# EAGLE design untitled (EAGLE 6.4)
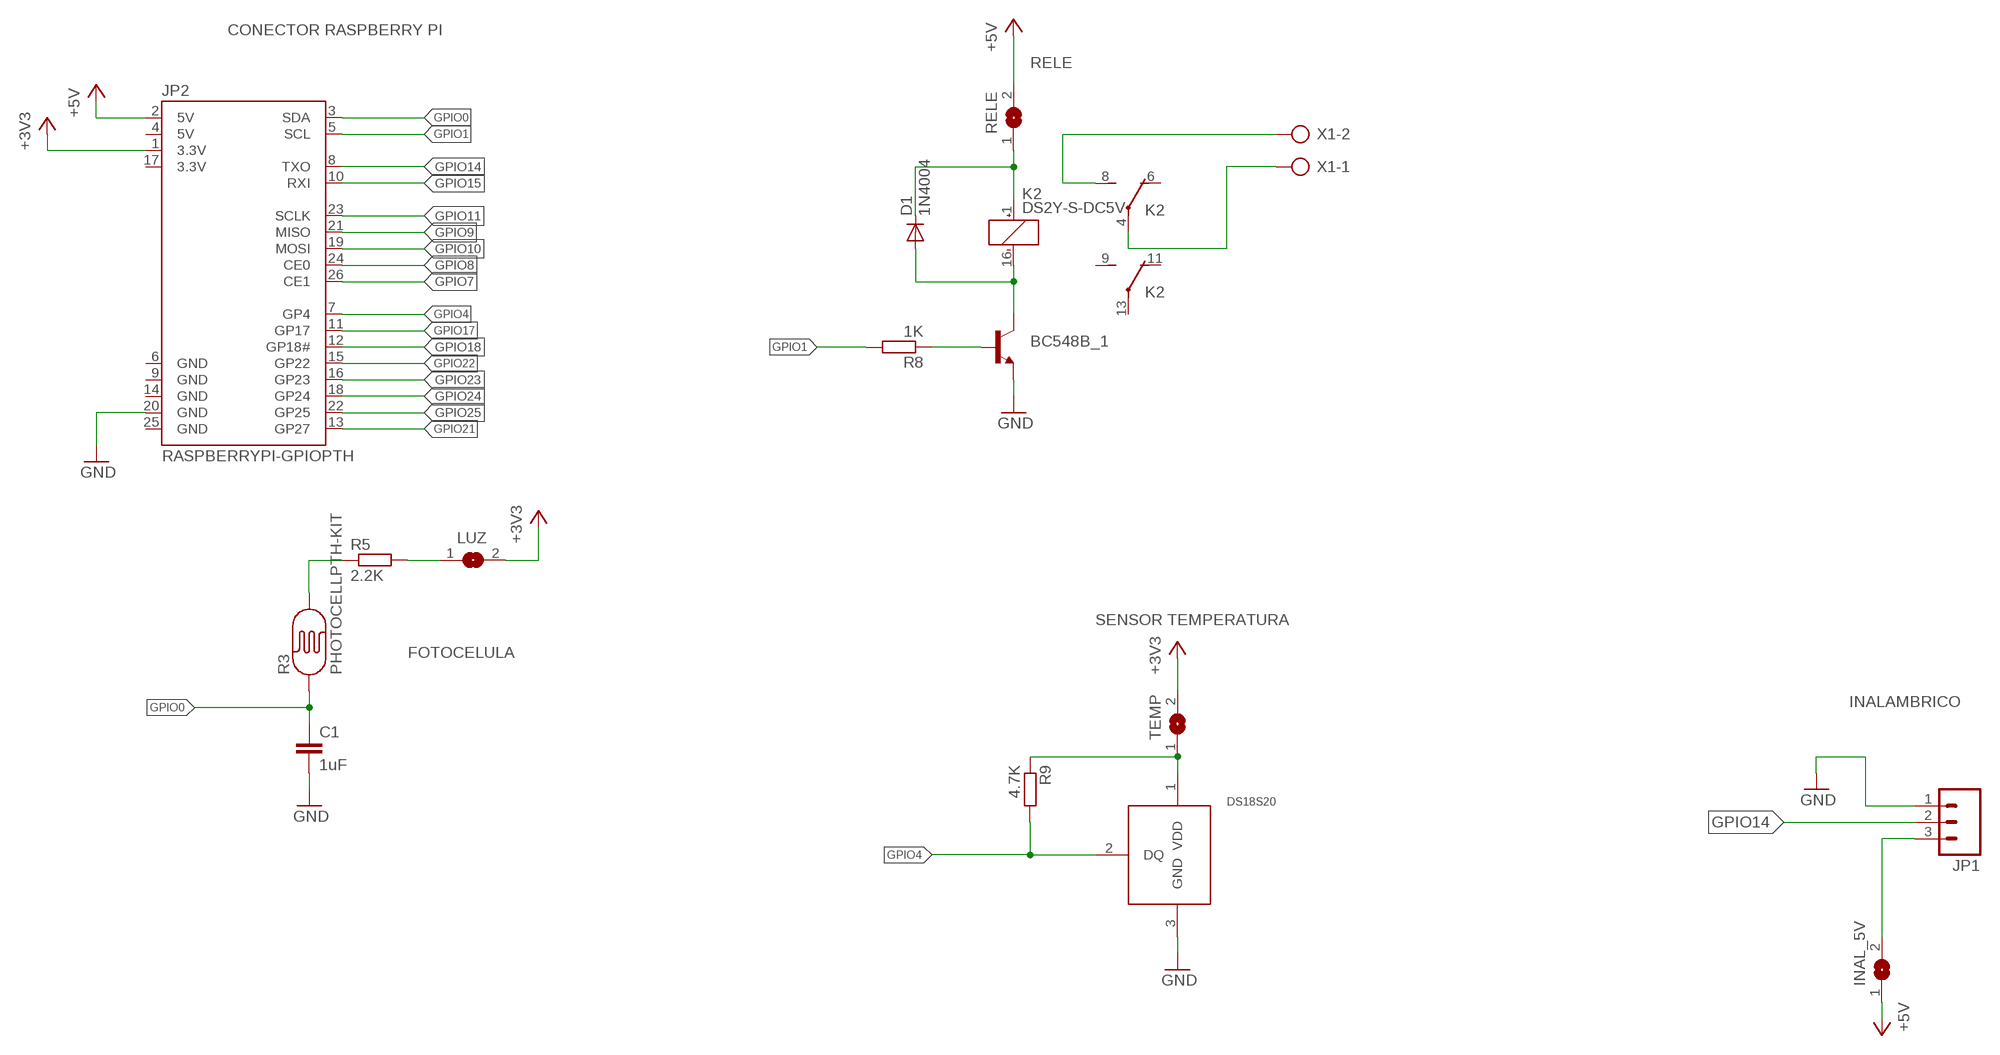
[diagram p0: schematic, sheet 1]

## Parts
BC548B_1  TRANSISTOR_NPNTO-92-AMMO  [TO-92-AMMO]
C1  1uF  C5/3.5  [C5B3.5]
D1  1N4004  [DO41-10]
DS18S20  18S20  [TO-92]
INAL_5V  SJ  [SJ]
JP1  M03POLAR  [MOLEX-1X3]
JP2  RASPBERRYPI-GPIOPTH  [2X13-SHROUDED]
K2  DS2Y-S-DC5V  [DS2Y]
LUZ  SJ  [SJ]
R3  PHOTOCELLPTH-KIT  [PHOTOCELL-KIT]
R5  2.2K  R-EU_0207/10  [0207/10]
R8  1K  R-EU_0207/10  [0207/10]
R9  4.7K  R-EU_0207/10  [0207/10]
RELE  SJ  [SJ]
TEMP  SJ  [SJ]
X1  AK500/2  [AK500/2]

## Nets
+3V3: JP2.1(3.3V) LUZ.2 TEMP.2
+5V: INAL_5V.1 JP2.2(5V) RELE.2
GND: BC548B_1.1(E) C1.2 DS18S20.3(GND) JP1.1 JP2.20(GND)
GPIO0: C1.1 JP2.3(SDA) R3.1
GPIO1: JP2.5(SCL) R8.2
GPIO4: DS18S20.2(DQ) JP2.7(GP4) R9.2
GPIO7: JP2.26(CE1)
GPIO8: JP2.24(CE0)
GPIO9: JP2.21(MISO)
GPIO10: JP2.19(MOSI)
GPIO11: JP2.23(SCLK)
GPIO14: JP1.2 JP2.8(TXO)
GPIO15: JP2.10(RXI)
GPIO17: JP2.11(GP17)
GPIO18: JP2.12(GP18#)
GPIO21: JP2.13(GP27)
GPIO22: JP2.15(GP22)
GPIO23: JP2.16(GP23)
GPIO24: JP2.18(GP24)
GPIO25: JP2.22(GP25)
N$1: BC548B_1.3(C) D1.A K2.16(1:-)
N$2: DS18S20.1(VDD) R9.1 TEMP.1
N$3: R3.2 R5.1
N$4: BC548B_1.2(B) R8.1
N$6: K2.8(2:S) X1.2
N$9: K2.4(2:P) X1.1
N$10: LUZ.1 R5.2
N$11: D1.C K2.1(1:+) RELE.1
N$14: INAL_5V.2 JP1.3
Unconnected: K2.6(2:O) K2.9(3:S) K2.11(3:O) K2.13(3:P)

## Notes on the sheet
- CONECTOR RASPBERRY PI
- RELE
- SENSOR TEMPERATURA
- FOTOCELULA
- INALAMBRICO

## Power pins joined to a net without a drawn wire
3.3V: JP2.17(3.3V)
5V: JP2.4(5V)
GND: JP2.6(GND) JP2.9(GND) JP2.14(GND) JP2.25(GND)

## Library data of the parts
BC548B_1 = SparkFun:TRANSISTOR_NPN: Transistor NPN BJT configuration in SOT23 package. MMBT2222 is the common NPN we use. Double check BCE configuration again layout.
C1 = capacitor-wima:C: CAPACITOR naming: grid - package width
D1 = diode:1N4004: DIODE general purpose rectifier, 1 A
DS18S20 = merriman:18S20: Dallas/Maxim 18S20 1-Wire temperature sensor (including PAR, since assumes pin 3 NOT connected internally on that variant)
INAL_5V LUZ RELE TEMP = jumper:SJ: SMD solder JUMPER
JP1 = SparkFun:M03: Header 3 Standard 3-pin 0.1" header. Use with straight break away headers (SKU : PRT-00116), right angle break away headers (PRT-00553), swiss pins (PRT-00743), machine pins (PRT-00117), and female headers (PRT-00115). Molex polarized connector foot print use with SKU : PRT-08232 with associated crimp pins and housings.
JP2 = SparkFun-Boards:RASPBERRYPI-GPIO: RASPBERRY PI I/O HEADER As defined for the Revistion 2 Pi.; DIST: sparkfun; DIST_ID: PRT-11490
K2 = relay:DS2Y-S-DC*: MINIATURE RELAY NAiS Source: http://www.mew-europe.com/.. en_ds_61005_0023.pdf
R3 = SparkFun:PHOTOCELL: Photocell Also known as a CdS photoresistor. This is a low cost way to detect light levels. Resistance decreases with more incoming light. SparkFun SKU: SEN-09088
R5 R8 R9 = rcl:R-EU_: RESISTOR, European symbol
X1 = con-ptr500:AK500/2: CONNECTOR

## Net classes
1 power: width 0.6 mm, clearance 0.3 mm

## Board
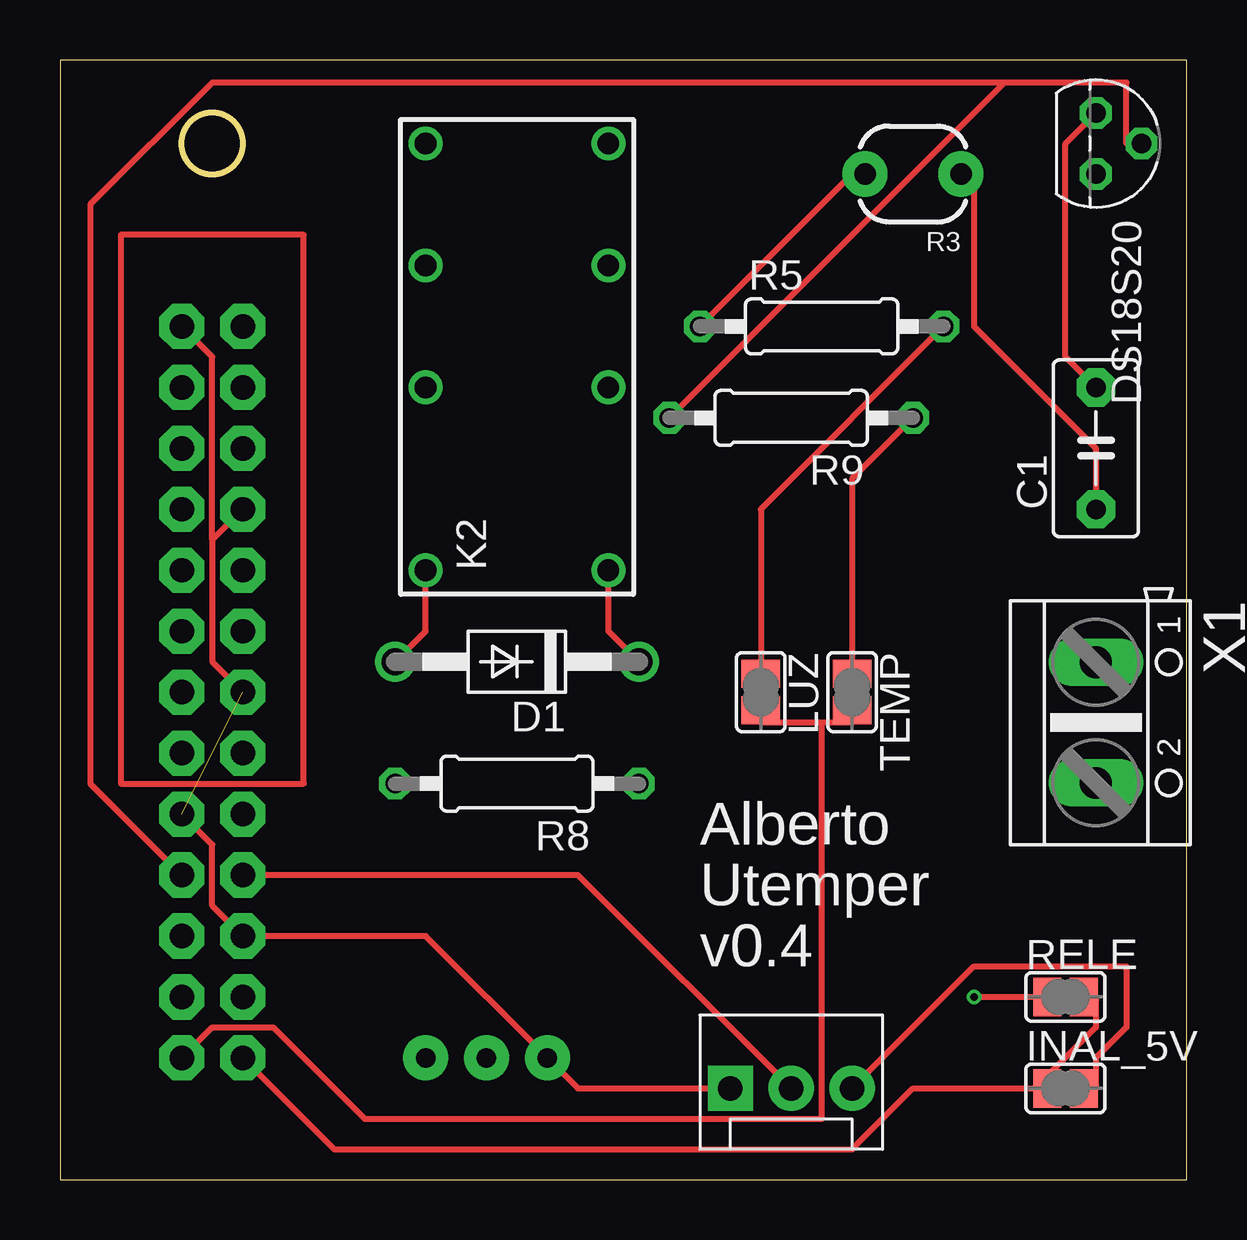
[diagram p1: board, top side]
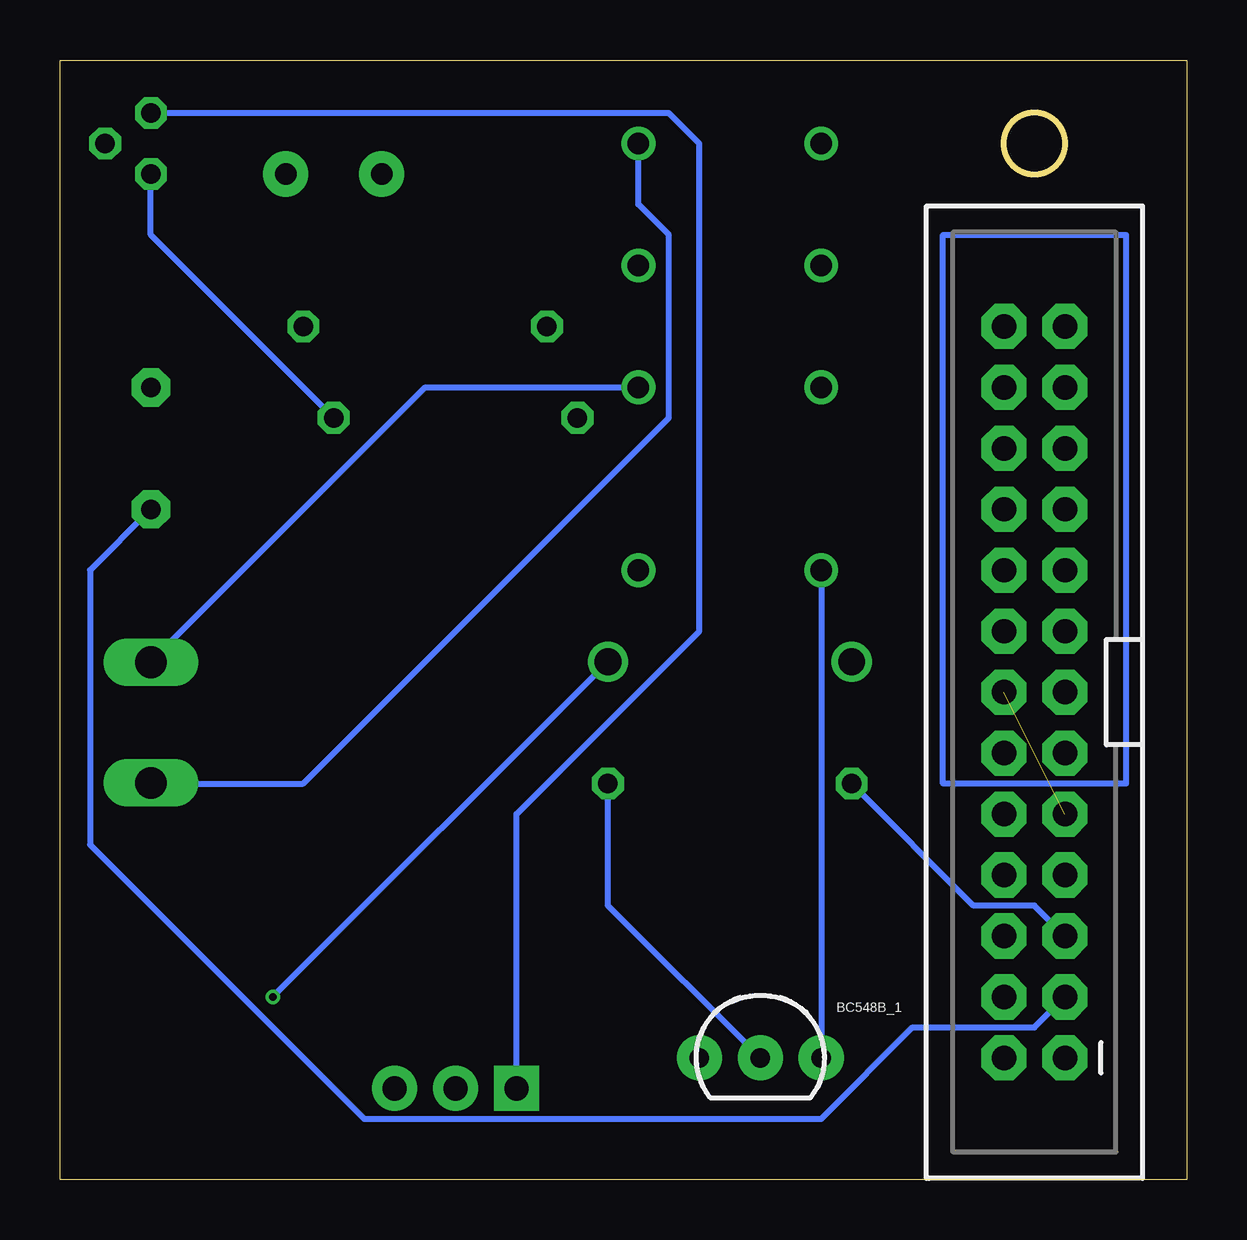
[diagram p2: board, bottom side, seen from below]

Size 46.97 x 46.66 mm. Coordinates in mm from the lower left corner, seen from the top.
Outline: 0,0 46.97,0 46.97,46.66 0,46.66 0,0
Outline: circle at 6.35,43.18 radius 1.27
Copper layers (1*16): Top 0.035mm / dielectric 1.5mm / Bottom 0.035mm
Design rules "SeeedStudio_DRU_no_angle_2layer": minimum track width 6mil, minimum drill 12mil, track to track 6mil, track to pad 6mil, pad to pad 6mil, via to via 6mil, smd to smd 0mil, copper to edge 10mil, drill to drill 10mil, minimum pad ring 10mil, minimum via ring 6mil, stop-mask expansion 2mil, vias tented up to drill 25mil, thermal gap 10mil

### Footprints (pad centres in the part's own frame; a part is rotated, then mirrored left to right if it is on the bottom)
TO-92-AMMO = drill 0.813 pad 1.88: 1 -2.54,0; 2 0,0; 3 2.54,0
C5B3.5 = drill 0.813 pad 1.6 octagon: 1 -2.54,0; 2 2.54,0
DO41-10 = drill 1.118: A 5.08,0; C -5.08,0
TO-92 = drill 0.813 octagon: 1 1.27,0; 2 0,1.905; 3 -1.27,0
SJ = smd 1.168 x 1.6: 1 -0.762,0; 2 0.762,0
MOLEX-1X3 = drill 1.016 pad 1.88 square: 1 0,0 | drill 1.016 pad 1.88: 2 2.54,0; 3 5.08,0
2X13-SHROUDED = drill 1.016 pad 1.88 octagon: 1 -1.27,15.24; 2 1.27,15.24; 3 -1.27,12.7; 4 1.27,12.7; 5 -1.27,10.16; 6 1.27,10.16; 7 -1.27,7.62; 8 1.27,7.62; 9 -1.27,5.08; 10 1.27,5.08; 11 -1.27,2.54; 12 1.27,2.54; 13 -1.27,0; 14 1.27,0; 15 -1.27,-2.54; 16 1.27,-2.54; 17 -1.27,-5.08; 18 1.27,-5.08; 19 -1.27,-7.62; 20 1.27,-7.62; 21 -1.27,-10.16; 22 1.27,-10.16; 23 -1.27,-12.7; 24 1.27,-12.7; 25 -1.27,-15.24; 26 1.27,-15.24
DS2Y = drill 0.9: 1 -8.89,-3.81; 4 -1.27,-3.81; 6 3.81,-3.81; 8 8.89,-3.81; 9 8.89,3.81; 11 3.81,3.81; 13 -1.27,3.81; 16 -8.89,3.81
PHOTOCELL-KIT = drill 0.9 pad 1.88: 1 -2,0; 2 2,0
0207/10 = drill 0.813 octagon: 1 -5.08,0; 2 5.08,0
AK500/2 = drill 1.321 long: 1 -2.515,0; 2 2.515,0

### Placement (x,y rotation side)
BC548B_1  17.78,5.08 0 bottom
C1  43.18,30.48 90 top
D1  19.05,21.59 180 top
DS18S20  43.18,43.18 270 top
INAL_5V  41.91,3.81 0 top
JP1  27.94,3.81 0 top
JP2  6.35,20.32 180 bottom
K2  19.05,34.29 90 top
LUZ  29.21,20.32 270 top
R3  35.56,41.91 180 top
R5  31.75,35.56 0 top
R8  19.05,16.51 180 top
R9  30.48,31.75 180 top
RELE  41.91,7.62 0 top
TEMP  33.02,20.32 270 top
X1  43.18,19.05 270 top

### Tracks (layer width: path | path; a pad name or v marks a point on that pad's centre or on a via)
+3V3
  Top 0.254: 31.75,19.05 33.02,19.05 TEMP.2 | 31.75,19.05 29.21,19.05 LUZ.2 | 31.75,19.05 31.75,2.54 12.7,2.54 8.89,6.35 6.35,6.35 JP2.1
+5V
  Top 0.254: 40.64,3.81 43.18,6.35 43.18,7.62 RELE.2 | 40.64,3.81 35.56,3.81 33.02,1.27 11.43,1.27 JP2.2 | 40.64,3.81 INAL_5V.1
GND  (1 unrouted)
  Top 0.254: JP2.14 6.35,21.59 6.35,26.67 | JP2.20 6.35,26.67 | JP2.25 6.35,34.29 6.35,26.67 | DS18S20.3 41.91,43.18 41.91,34.29 C1.2 | JP2.9 6.35,13.97 6.35,11.43 JP2.6 15.24,10.16 BC548B_1.1 21.59,3.81 JP1.1
  Bottom 0.254: DS18S20.3 21.59,44.45 20.32,43.18 20.32,22.86 27.94,15.24 JP1.1
GPIO0
  Top 0.254: C1.1 43.18,30.48 38.1,35.56 38.1,41.91 R3.1
  Bottom 0.254: JP2.3 6.35,6.35 11.43,6.35 15.24,2.54 34.29,2.54 45.72,13.97 45.72,25.4 C1.1
GPIO1
  Bottom 0.254: R8.2 8.89,11.43 6.35,11.43 JP2.5
GPIO4
  Top 0.254: 39.37,45.72 R9.2 | 39.37,45.72 44.45,45.72 44.45,43.18 DS18S20.2 | JP2.7 1.27,16.51 1.27,40.64 6.35,45.72 39.37,45.72
GPIO14
  Top 0.254: JP2.8 21.59,12.7 JP1.2
N$1
  Top 0.254: K2.16 15.24,22.86 D1.A
  Bottom 0.254: K2.16 BC548B_1.3
N$2
  Top 0.254: TEMP.1 33.02,29.21 R9.1
  Bottom 0.254: DS18S20.1 43.18,39.37 R9.1
N$3
  Top 0.254: R5.1 33.02,41.91 R3.2
N$4
  Bottom 0.254: R8.1 24.13,11.43 BC548B_1.2
N$5
  Top 0.254: 2.54,39.37 2.54,16.51 10.16,16.51 10.16,39.37 2.54,39.37
N$6
  Bottom 0.254: K2.8 22.86,40.64 21.59,39.37 21.59,31.75 36.83,16.51 43.18,16.51 X1.2
N$7
  Bottom 0.254: 2.54,39.37 2.54,16.51 10.16,16.51 10.16,39.37 2.54,39.37
N$9
  Bottom 0.254: K2.4 31.75,33.02 43.18,21.59 X1.1
N$10
  Top 0.254: LUZ.1 29.21,27.94 R5.2
N$11  (via drill 0.3)
  Top 0.254: v38.1,7.62 RELE.1 | K2.1 22.86,22.86 D1.C
  Bottom 0.254: D1.C v38.1,7.62
N$14
  Top 0.254: JP1.3 38.1,8.89 44.45,8.89 44.45,6.35 43.18,5.08 43.18,3.81 INAL_5V.2

### Text on the board
tNames: Alberto | Utemper | v0.4